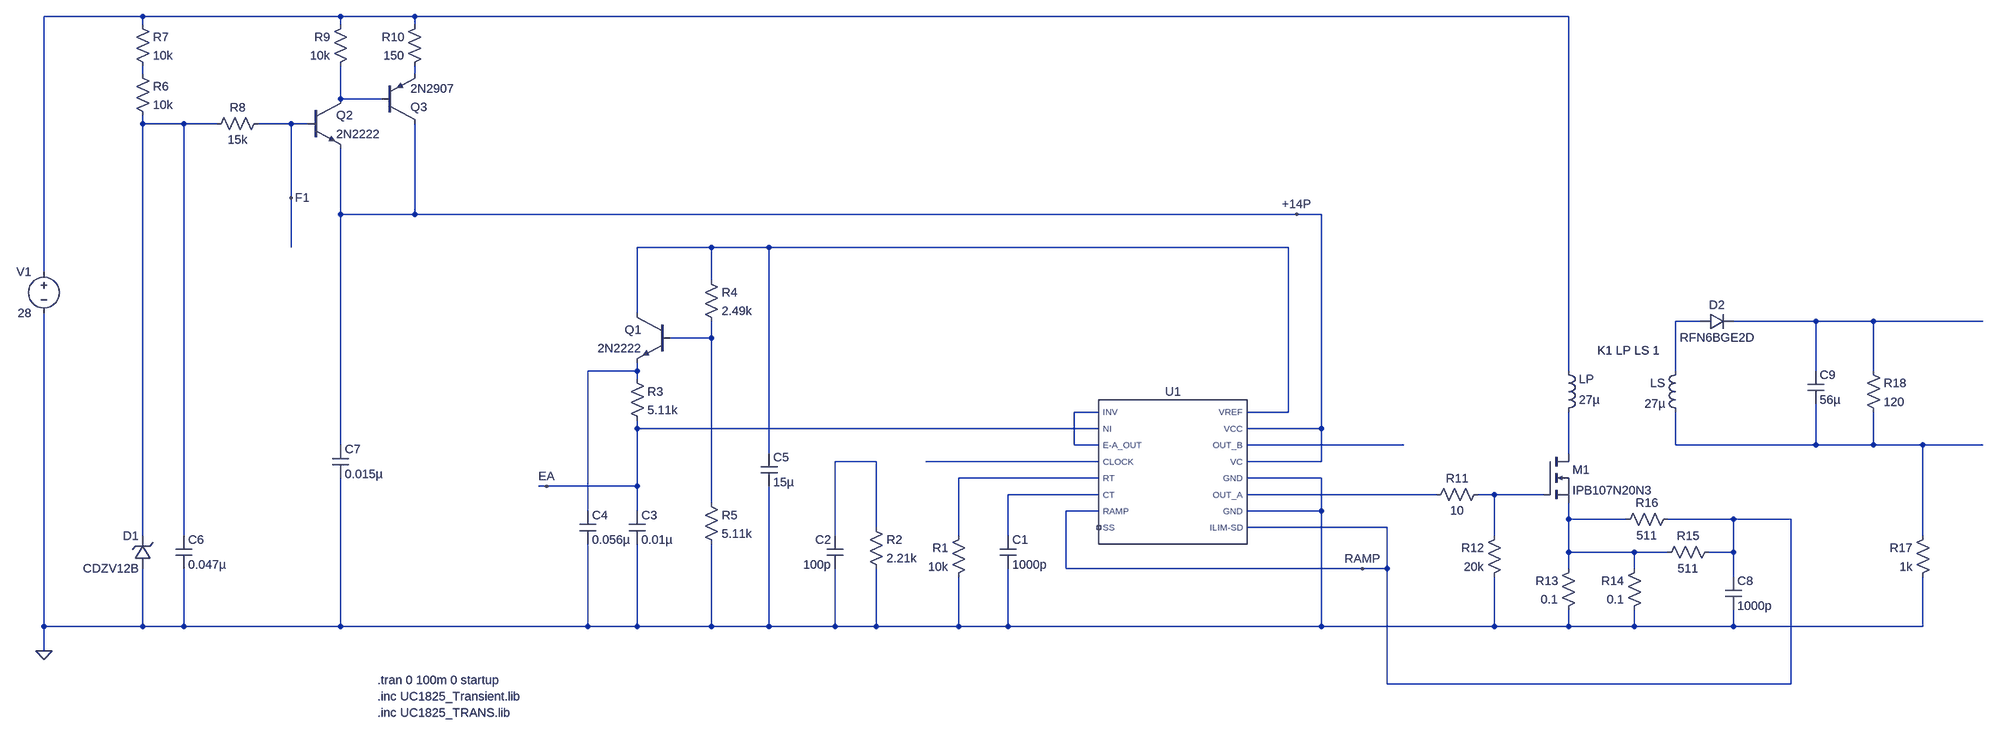
[diagram p0: schematic Flyback_Converter_w_UC1825.asc]
Flyback_Converter_w_UC1825.asc, the LTspice schematic file:
Version 4.1
SHEET 1 1924 680
WIRE -1744 -736 -1936 -736
WIRE -1360 -736 -1744 -736
WIRE -1216 -736 -1360 -736
WIRE 1024 -736 -1216 -736
WIRE -1744 -720 -1744 -736
WIRE -1360 -720 -1360 -736
WIRE -1216 -720 -1216 -736
WIRE -1744 -624 -1744 -640
WIRE -1216 -624 -1216 -640
WIRE -1360 -576 -1360 -640
WIRE -1280 -576 -1360 -576
WIRE -1744 -528 -1744 -544
WIRE -1664 -528 -1744 -528
WIRE -1600 -528 -1664 -528
WIRE -1456 -528 -1520 -528
WIRE -1424 -528 -1456 -528
WIRE -1456 -384 -1456 -528
WIRE -1360 -352 -1360 -480
WIRE -1216 -352 -1216 -528
WIRE -1216 -352 -1360 -352
WIRE 496 -352 -1216 -352
WIRE 544 -352 496 -352
WIRE -1456 -288 -1456 -384
WIRE -640 -288 -784 -288
WIRE -528 -288 -640 -288
WIRE 480 -288 -528 -288
WIRE -1936 -240 -1936 -736
WIRE -640 -224 -640 -288
WIRE -784 -160 -784 -288
WIRE 1280 -144 1232 -144
WIRE 1504 -144 1344 -144
WIRE 1616 -144 1504 -144
WIRE 1920 -144 1616 -144
WIRE -640 -112 -640 -144
WIRE -640 -112 -720 -112
WIRE -784 -48 -784 -64
WIRE -784 -48 -880 -48
WIRE 1024 -48 1024 -736
WIRE 1232 -48 1232 -144
WIRE 1504 -48 1504 -144
WIRE 1616 -48 1616 -144
WIRE -784 -32 -784 -48
WIRE 112 32 64 32
WIRE 480 32 480 -288
WIRE 480 32 400 32
WIRE -784 64 -784 48
WIRE 112 64 -784 64
WIRE 544 64 544 -352
WIRE 544 64 400 64
WIRE -1360 96 -1360 -352
WIRE 64 96 64 32
WIRE 112 96 64 96
WIRE 704 96 400 96
WIRE 1232 96 1232 32
WIRE 1504 96 1504 16
WIRE 1504 96 1232 96
WIRE 1616 96 1616 32
WIRE 1616 96 1504 96
WIRE 1712 96 1616 96
WIRE 1920 96 1712 96
WIRE -528 112 -528 -288
WIRE 1024 112 1024 32
WIRE -320 128 -400 128
WIRE 112 128 -224 128
WIRE 544 128 544 64
WIRE 544 128 400 128
WIRE 112 160 -160 160
WIRE 544 160 400 160
WIRE -960 176 -976 176
WIRE -784 176 -784 64
WIRE -784 176 -960 176
WIRE 112 192 -64 192
WIRE 768 192 400 192
WIRE 880 192 848 192
WIRE 976 192 880 192
WIRE -640 208 -640 -112
WIRE -880 224 -880 -48
WIRE -784 224 -784 176
WIRE 112 224 48 224
WIRE 544 224 544 160
WIRE 544 224 400 224
WIRE 1024 240 1024 208
WIRE 1136 240 1024 240
WIRE 1344 240 1216 240
WIRE 1456 240 1344 240
WIRE -320 256 -320 128
WIRE 672 256 400 256
WIRE -1744 272 -1744 -528
WIRE -1664 272 -1664 -528
WIRE -400 272 -400 128
WIRE -160 272 -160 160
WIRE -64 272 -64 192
WIRE 880 272 880 192
WIRE 1712 272 1712 96
WIRE 1024 304 1024 240
WIRE 1152 304 1024 304
WIRE 1216 304 1152 304
WIRE 1344 304 1344 240
WIRE 1344 304 1296 304
WIRE 48 336 48 224
WIRE 624 336 48 336
WIRE 672 336 672 256
WIRE 672 336 624 336
WIRE 1024 336 1024 304
WIRE 1152 336 1152 304
WIRE 1344 352 1344 304
WIRE -1936 448 -1936 -160
WIRE -1744 448 -1744 336
WIRE -1744 448 -1936 448
WIRE -1664 448 -1664 336
WIRE -1664 448 -1744 448
WIRE -1360 448 -1360 160
WIRE -1360 448 -1664 448
WIRE -880 448 -880 288
WIRE -880 448 -1360 448
WIRE -784 448 -784 288
WIRE -784 448 -880 448
WIRE -640 448 -640 288
WIRE -640 448 -784 448
WIRE -528 448 -528 176
WIRE -528 448 -640 448
WIRE -400 448 -400 336
WIRE -400 448 -528 448
WIRE -320 448 -320 336
WIRE -320 448 -400 448
WIRE -160 448 -160 352
WIRE -160 448 -320 448
WIRE -64 448 -64 336
WIRE -64 448 -160 448
WIRE 544 448 544 224
WIRE 544 448 -64 448
WIRE 880 448 880 352
WIRE 880 448 544 448
WIRE 1024 448 1024 416
WIRE 1024 448 880 448
WIRE 1152 448 1152 416
WIRE 1152 448 1024 448
WIRE 1344 448 1344 416
WIRE 1344 448 1152 448
WIRE 1712 448 1712 352
WIRE 1712 448 1344 448
WIRE -1936 496 -1936 448
WIRE 672 560 672 336
WIRE 1456 560 1456 240
WIRE 1456 560 672 560
FLAG 624 336 RAMP
FLAG -1936 496 0
FLAG -960 176 EA
FLAG 496 -352 +14P
FLAG -1456 -384 F1
SYMBOL cap -80 272 R0
SYMATTR InstName C1
SYMATTR Value 1000p
SYMBOL res -144 256 M0
SYMATTR InstName R1
SYMATTR Value 10k
SYMBOL res -336 240 R0
SYMATTR InstName R2
SYMATTR Value 2.21k
SYMBOL cap -384 272 M0
SYMATTR InstName C2
SYMATTR Value 100p
SYMBOL cap -800 224 R0
SYMATTR InstName C3
SYMATTR Value 0.01µ
SYMBOL res -800 -48 R0
SYMATTR InstName R3
SYMATTR Value 5.11k
SYMBOL cap -896 224 R0
SYMATTR InstName C4
SYMATTR Value 0.056µ
SYMBOL npn -720 -160 M0
SYMATTR InstName Q1
SYMATTR Value 2N2222
SYMBOL cap -544 112 R0
SYMATTR InstName C5
SYMATTR Value 15µ
SYMBOL res -656 -240 R0
SYMATTR InstName R4
SYMATTR Value 2.49k
SYMBOL res -656 192 R0
SYMATTR InstName R5
SYMATTR Value 5.11k
SYMBOL voltage -1936 -256 M0
WINDOW 123 0 0 Left 0
WINDOW 39 0 0 Left 0
SYMATTR InstName V1
SYMATTR Value 28
SYMBOL zener -1728 336 R180
WINDOW 0 24 64 Left 2
WINDOW 3 24 0 Left 2
SYMATTR InstName D1
SYMATTR Value CDZV12B
SYMBOL cap -1680 272 R0
SYMATTR InstName C6
SYMATTR Value 0.047µ
SYMBOL res -1760 -640 R0
SYMATTR InstName R6
SYMATTR Value 10k
SYMBOL res -1760 -736 R0
SYMATTR InstName R7
SYMATTR Value 10k
SYMBOL res -1504 -544 R90
WINDOW 0 0 56 VBottom 2
WINDOW 3 32 56 VTop 2
SYMATTR InstName R8
SYMATTR Value 15k
SYMBOL npn -1424 -576 R0
SYMATTR InstName Q2
SYMATTR Value 2N2222
SYMBOL pnp -1280 -528 M180
SYMATTR InstName Q3
SYMATTR Value 2N2907
SYMBOL res -1344 -736 M0
SYMATTR InstName R9
SYMATTR Value 10k
SYMBOL res -1200 -736 M0
SYMATTR InstName R10
SYMATTR Value 150
SYMBOL cap -1376 96 R0
SYMATTR InstName C7
SYMATTR Value 0.015µ
SYMBOL res 864 176 R90
WINDOW 0 0 56 VBottom 2
WINDOW 3 32 56 VTop 2
SYMATTR InstName R11
SYMATTR Value 10
SYMBOL nmos 976 112 R0
SYMATTR InstName M1
SYMATTR Value IPB107N20N3
SYMBOL res 896 256 M0
SYMATTR InstName R12
SYMATTR Value 20k
SYMBOL res 1040 320 M0
SYMATTR InstName R13
SYMATTR Value 0.1
SYMBOL res 1168 320 M0
SYMATTR InstName R14
SYMATTR Value 0.1
SYMBOL res 1312 288 R90
WINDOW 0 0 56 VBottom 2
WINDOW 3 32 56 VTop 2
SYMATTR InstName R15
SYMATTR Value 511
SYMBOL res 1232 224 R90
WINDOW 0 0 56 VBottom 2
WINDOW 3 32 56 VTop 2
SYMATTR InstName R16
SYMATTR Value 511
SYMBOL cap 1328 352 R0
SYMATTR InstName C8
SYMATTR Value 1000p
SYMBOL ind 1008 48 M180
WINDOW 0 36 80 Left 2
WINDOW 3 36 40 Left 2
SYMATTR InstName LP
SYMATTR Value 27µ
SYMATTR Type ind
SYMBOL ind 1248 -64 M0
SYMATTR InstName LS
SYMATTR Value 27µ
SYMATTR Type ind
SYMBOL res 1728 256 M0
SYMATTR InstName R17
SYMATTR Value 1k
SYMBOL diode 1280 -128 R270
WINDOW 0 32 32 VTop 2
WINDOW 3 0 32 VBottom 2
SYMATTR InstName D2
SYMATTR Value RFN6BGE2D
SYMBOL cap 1488 -48 R0
SYMATTR InstName C9
SYMATTR Value 56µ
SYMBOL res 1600 -64 R0
SYMATTR InstName R18
SYMATTR Value 120
SYMBOL UC1825_TRANS 256 176 R0
SYMATTR InstName U1
TEXT -1288 552 Left 2 !.tran 0 100m 0 startup
TEXT -1288 584 Left 2 !.inc UC1825_Transient.lib
TEXT 1080 -88 Left 2 !K1 LP LS 1
TEXT -1288 616 Left 2 !.inc UC1825_TRANS.lib

The netlist it stands for:
* Flyback_Converter_w_UC1825.asc
C1 N018 0 1000p
R1 N017 0 10k
R2 N015 0 2.21k
C2 N015 0 100p
C3 EA 0 0.01µ
R3 N010 EA 5.11k
C4 N010 0 0.056µ
Q1 N006 N009 N010 0 2N2222
C5 N006 0 15µ
R4 N006 N009 2.49k
R5 N009 0 5.11k
V1 N001 0 28
D1 0 N005 CDZV12B
C6 N005 0 0.047µ
R6 N002 N005 10k
R7 N001 N002 10k
R8 F1 N005 15k
Q2 N004 F1 +14P 0 2N2222
Q3 +14P N004 N003 0 2N2907
R9 N001 N004 10k
R10 N001 N003 150
C7 +14P 0 0.015µ
R11 N020 N019 10
M1 N014 N020 N021 N021 IPB107N20N3
R12 N020 0 20k
R13 N021 0 0.1
R14 N021 0 0.1
R15 RAMP N021 511
R16 RAMP N021 511
C8 RAMP 0 1000p
LP N014 N001 27µ
LS N007 N013 27µ
R17 N013 0 1k
D2 N007 N008 RFN6BGE2D
C9 N008 N013 56µ
R18 N008 N013 120
X§U1 N019 N012 RAMP RAMP N018 0 +14P +14P N006 EA N011 N011 N016 N017 0 NC_01 UC1825_TRANS  ; pins OUT_A OUT_B ILIM-SD RAMP CT GND VCC VC VREF NI INV E-A_OUT CLOCK RT GND SS
.model D D
.lib standard.dio
.model NPN NPN
.model PNP PNP
.lib standard.bjt
.model NMOS NMOS
.model PMOS PMOS
.lib standard.mos
.tran 0 100m 0 startup
.inc UC1825_Transient.lib
K1 LP LS 1
.inc UC1825_TRANS.lib
.backanno
.end